# EAGLE schematic Zvukovuha2 (EAGLE 7.2.0)
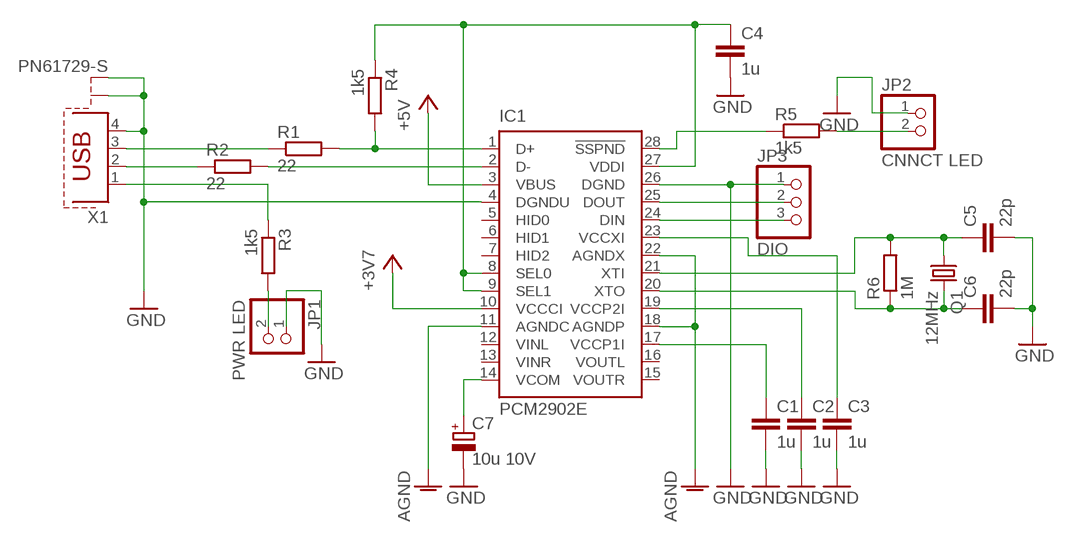
[diagram p0: schematic, sheet 1]

## Parts
C1  1u  C-EUC0805  [C0805]
C2  1u  C-EUC0805  [C0805]
C3  1u  C-EUC0805  [C0805]
C4  1u  C-EUC0805  [C0805]
C5  22p  C-EUC0805  [C0805]
C6  22p  C-EUC0805  [C0805]
C7  10u 10V  CPOL-EUUD-6,3X7,7  [UD-6,3X7,7_NICHICON]
IC1  PCM2902E  [SSOP28DB]
JP1  PWR LED  PINHD-1X2  [1X02]
JP2  CNNCT LED  PINHD-1X2  [1X02]
JP3  DIO  PINHD-1X3  [1X03]
Q1  12MHz  CSM-7X-DU  [CSM-7X-DU]
R1  22  R-EU_M1206  [M1206]
R2  22  R-EU_M1206  [M1206]
R3  1k5  R-EU_M1206  [M1206]
R4  1k5  R-EU_M1206  [M1206]
R5  1k5  R-EU_M1206  [M1206]
R6  1M  R-EU_M1206  [M1206]
X1  PN61729-S  [PN61729-S]

## Nets
+3V7: IC1.10(VCCCI)
+5V: IC1.3(VBUS)
AGND: IC1.11(AGNDC) IC1.18(AGNDP) IC1.22(AGNDX)
GND: C1.2 C2.2 C3.2 C4.2 C5.2 C6.2 C7.- IC1.4(DGNDU) IC1.26(DGND) JP1.1 JP2.1 JP3.1 X1.4 X1.S1 X1.S2
N$1: R2.1 X1.2
N$2: IC1.2(D-) R2.2
N$3: R1.1 X1.3
N$4: IC1.1(D+) R1.2 R4.2
N$5: R3.1 X1.1
N$6: JP1.2 R3.2
N$7: C1.1 IC1.17(VCCP1I)
N$8: C2.1 IC1.19(VCCP2I)
N$9: C3.1 IC1.23(VCCXI)
N$10: C4.1 IC1.8(SEL0) IC1.9(SEL1) IC1.27(VDDI) R4.1
N$11: IC1.28(!SSPND) R5.1
N$12: JP2.2 R5.2
N$13: C5.1 IC1.21(XTI) Q1.1 R6.2
N$14: C6.1 IC1.20(XTO) Q1.2 R6.1
N$15: IC1.25(DOUT) JP3.2
N$16: IC1.24(DIN) JP3.3
N$17: C7.+ IC1.14(VCOM)
Unconnected: IC1.5(HID0) IC1.6(HID1) IC1.7(HID2) IC1.12(VINL) IC1.13(VINR) IC1.15(VOUTR) IC1.16(VOUTL)

## Library data of the parts
C1-C6 = rcl:C-EU: CAPACITOR, European symbol
C7 = rcl:CPOL-EU: POLARIZED CAPACITOR, European symbol
IC1 = texas:PCM290*: STEREO AUDIO CODEC WITH USB INTERFACE SINGLE-ENDED ANALOG INPUT/OUTPUT AND S/PDIF; MF: TEXAS INSTRUMENT CONNECTORS; MPN: PCM2902E; OC_FARNELL: 1207089; OC_NEWARK: 75C5380
JP1 JP2 = pinhead:PINHD-1X2: PIN HEADER
JP3 = pinhead:PINHD-1X3: PIN HEADER
Q1 = crystal:CSM-7X-DU: SMD CRYSTAL Source: www.ecsxtal.com .. Crystal 3.6864MHz CSM_7X_DU.PDF; OC_FARNELL: unknown; OC_NEWARK: unknown
R1-R6 = rcl:R-EU_: RESISTOR, European symbol
X1 = con-berg:PN61729-S: BERG USB connector; OC_FARNELL: unknown; OC_NEWARK: unknown